# EAGLE design board (EAGLE 6.4)
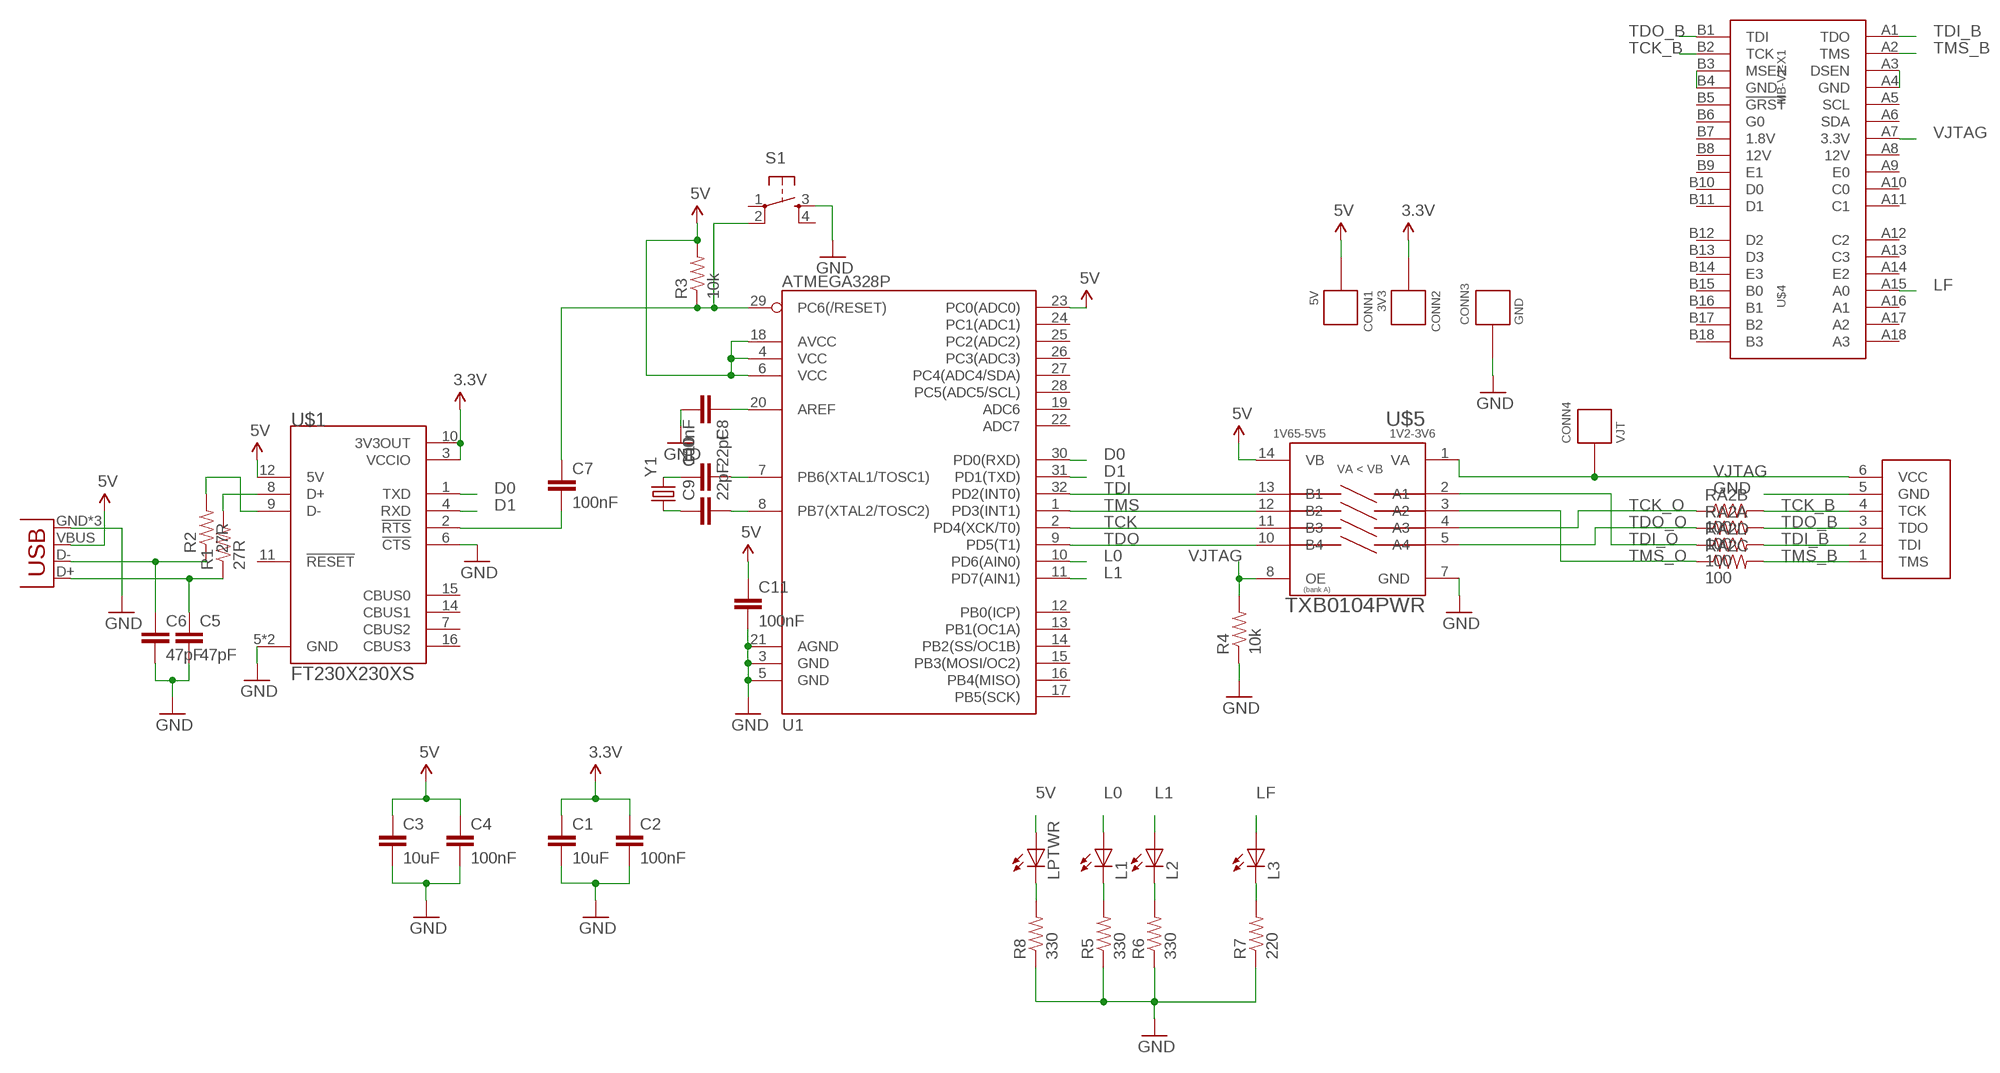
[diagram p0: schematic, sheet 1]

## Parts
C1  10uF  CAP0805  [0805]
C2  100nF  CAP0402-CAP  [0402-CAP]
C3  10uF  CAP0805  [0805]
C4  100nF  CAP0402-CAP  [0402-CAP]
C5  47pF  CAP0402-CAP  [0402-CAP]
C6  47pF  CAP0402-CAP  [0402-CAP]
C7  100nF  CAP0402-CAP  [0402-CAP]
C8  100nF  CAP0402-CAP  [0402-CAP]
C9  22pF  CAP0402-CAP  [0402-CAP]
C10  22pF  CAP0402-CAP  [0402-CAP]
C11  100nF  CAP0402-CAP  [0402-CAP]
CONN1  5V  CONNECTOR22AWG  [HOLE_22AWG]
CONN2  3V3  CONNECTOR22AWG  [HOLE_22AWG]
CONN3  GND  CONNECTOR22AWG  [HOLE_22AWG]
CONN4  VJT  CONNECTOR22AWG  [HOLE_22AWG]
JP1  USB-MICROB  [USB-MICROB]
L1  LED0603  [0603_LED]
L2  LED0603  [0603_LED]
L3  LED0603  [0603_LED]
LPTWR  LED0603  [0603_LED]
R1  27R  RESISTOR0603  [0603-RES]
R2  27R  RESISTOR0603  [0603-RES]
R3  10k  RESISTOR0603  [0603-RES]
R4  10k  RESISTOR0603  [0603-RES]
R5  330  RESISTOR0603  [0603-RES]
R6  330  RESISTOR0603  [0603-RES]
R7  220  RESISTOR0603  [0603-RES]
R8  330  RESISTOR0603  [0603-RES]
RA2  100  RESISTOR_ARRAY0603_X4  [0603-ARV]
S1  TAC_SWITCHPTH  [TACTILE-PTH]
U1  ATMEGA328P  ATMEGA328_SMT  [TQFP32-08]
U$1  FT230X230XS  [SO16]
U$2  JTAGDIGILENT  [1X06]
U$4  MB-V1-X1  [PCIE-X1-EDGE]
U$5  TXB0104PWR  [TSSOP14]
Y1  CRYSTALHC49US  [HC49US]

## Nets
3.3V: C1.1 C2.1 CONN2.P U$1.3(VCCIO) U$1.10(3V3OUT)
5V: C3.1 C4.1 C11.1 CONN1.P JP1.VBUS LPTWR.A R3.2 U1.4(VCC) U1.6(VCC) U1.18(AVCC) U1.23(PC0(ADC0)) U$1.12(5V) U$5.14(VB)
D0: U1.30(PD0(RXD)) U$1.1(TXD)
D1: U1.31(PD1(TXD)) U$1.4(RXD)
GND: C1.2 C2.2 C3.2 C4.2 C5.2 C6.2 C8.2 C11.2 CONN3.P JP1.GND JP1.MT1(GND) JP1.MT2(GND) R4.1 R5.1 R6.1 R7.1 R8.1 S1.3 U1.3(GND) U1.5(GND) U1.21(AGND) U$1.5(GND) U$1.6(!CTS) U$1.13(GND) U$2.5(GND) U$4.A3(DSEN) U$4.A4(GND) U$4.B3(MSEN) U$4.B4(GND)
L0: L1.A U1.10(PD6(AIN0))
L1: L2.A U1.11(PD7(AIN1))
LF: L3.A U$4.A15(A0)
LPWR: LPTWR.C R8.2
N$1: R1.2 U$1.8(D+)
N$2: R2.2 U$1.9(D-)
N$3: C6.1 JP1.D- R2.1
N$4: C5.1 JP1.D+ R1.1
N$5: C7.2 U$1.2(!RTS)
N$6: C7.1 R3.1 S1.2 U1.29(PC6(/RESET))
N$7: C10.2 U1.7(PB6(XTAL1/TOSC1))
N$8: C8.1 U1.20(AREF)
N$9: C10.1 Y1.2
N$10: C9.2 U1.8(PB7(XTAL2/TOSC2))
N$11: C9.1 Y1.1
N$12: L1.C R5.2
N$13: L2.C R6.2
N$14: L3.C R7.2
TCK: U1.2(PD4(XCK/T0)) U$5.11(B3)
TCK_B: RA2.7 U$2.4(TCK) U$4.B2(TCK)
TCK_O: RA2.2 U$5.4(A3)
TDI: U1.32(PD2(INT0)) U$5.13(B1)
TDI_B: RA2.5 U$2.2(TDI) U$4.A1(TDO)
TDI_O: RA2.4 U$5.2(A1)
TDO: U1.9(PD5(T1)) U$5.10(B4)
TDO_B: RA2.8 U$2.3(TDO) U$4.B1(TDI)
TDO_O: RA2.1 U$5.5(A4)
TMS: U1.1(PD3(INT1)) U$5.12(B2)
TMS_B: RA2.6 U$2.1(TMS) U$4.A2(TMS)
TMS_O: RA2.3 U$5.3(A2)
VJTAG: CONN4.P R4.2 U$2.6(VCC) U$4.A7(3.3V) U$5.1(VA)
Unconnected: S1.1 S1.4 U1.12(PB0(ICP)) U1.13(PB1(OC1A)) U1.14(PB2(SS/OC1B)) U1.15(PB3(MOSI/OC2)) U1.16(PB4(MISO)) U1.17(PB5(SCK)) U1.19(ADC6) U1.22(ADC7) U1.24(PC1(ADC1)) U1.25(PC2(ADC2)) U1.26(PC3(ADC3)) U1.27(PC4(ADC4/SDA)) U1.28(PC5(ADC5/SCL)) U$1.7(CBUS2) U$1.11(!RESET) U$1.14(CBUS1) U$1.15(CBUS0) U$1.16(CBUS3) U$4.A5(SCL) U$4.A6(SDA) U$4.A8(12V) U$4.A9(E0) U$4.A10(C0) U$4.A11(C1) U$4.A12(C2) U$4.A13(C3) U$4.A14(E2) U$4.A16(A1) U$4.A17(A2) U$4.A18(A3) U$4.B5(!GRST) U$4.B6(G0) U$4.B7(1.8V) U$4.B8(12V) U$4.B9(E1) U$4.B10(D0) U$4.B11(D1) U$4.B12(D2) U$4.B13(D3) U$4.B14(E3) U$4.B15(B0) U$4.B16(B1) U$4.B17(B2) U$4.B18(B3) U$5.7(GND) U$5.8(OE)

## Library data of the parts
C1-C11 = kmod-passives:CAP: Capacitor Standard 0603 ceramic capacitor, and 0.1" leaded capacitor.
CONN1-CONN4 = kmod-nonparts:CONNECTOR: Collection of holes/pads for testing/connecting
JP1 = SparkFun-Connectors:USB: USB Connectors USB-B-PTH is fully proven SKU : PRT-00139/CONN-08278 USB-miniB is fully proven SKU : PRT-00587 USB-A-PCB is untested. USB-A-H is throughly reviewed, but untested. Spark Fun Electronics SKU : PRT-00437 USB-B-SMT is throughly reviewed, but untested. Needs silkscreen touching up. USB-A-S has not been used/tested USB-MB-H has not been used/tested USB-MICROB has been used. CONN-09505; PROD_ID: CONN-09505
L1-L3 LPTWR = kmod-passives:LED
R1-R8 = kmod-passives:RESISTOR: Resistor Basic schematic elements and footprints for 0603, 1206, and PTH resistors.
RA2 = kmod-passives:RESISTOR_ARRAY
S1 = kmod-mechanical:TAC_SWITCH: Momentary Switch Button commonly used for reset or general input. Spark Fun Electronics SKU : COM-00097 SMT- SWCH-08247
U1 = SparkFun-DigitalIC:ATMEGA328_SMT: 32-Pin Atmega328 part Commonly used on Arduino compatible boards Available in QFP and QFN packages TQFP is IC-09069 QFN is non-stock; PROD_ID: IC-09069
U$1 = kmod-testing:FT230X
U$2 = kmod-connectors:JTAG: JTAG connector, as on the Digilent Nexys3
U$4 = kmod-connectors:MB-V1-X1
U$5 = kmod-testing:TXB0104: TI 4-bit bidirectional voltage translator
Y1 = SparkFun-FreqCtrl:CRYSTAL: Various standard crystals. Proven footprints. Spark Fun Electronics SKU : COM-00534

## Board
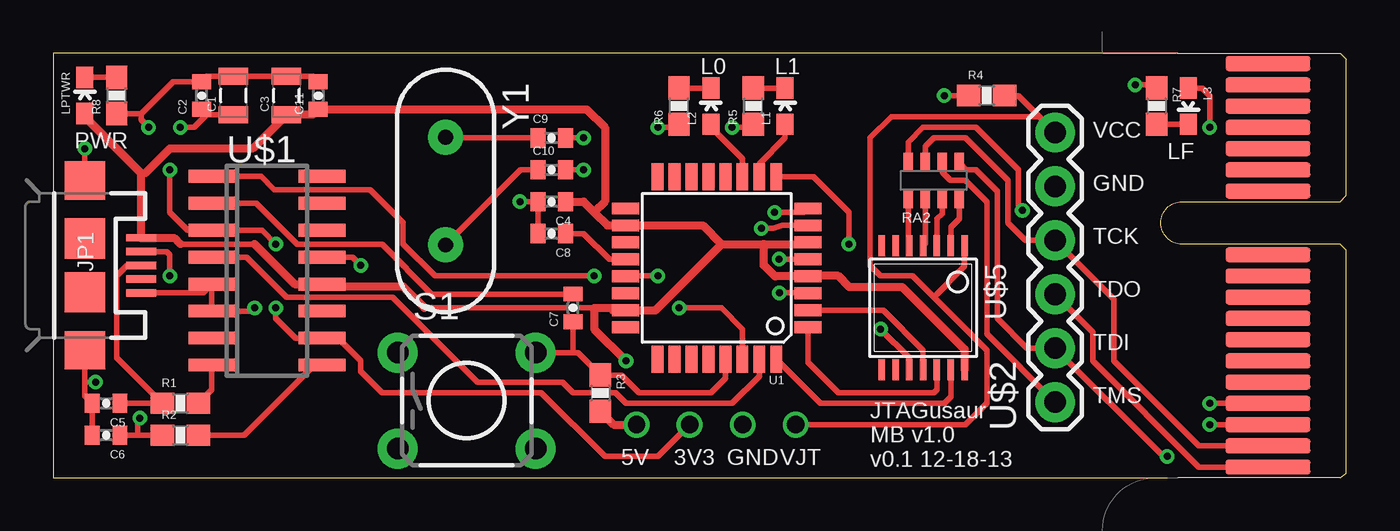
[diagram p1: board, top side]
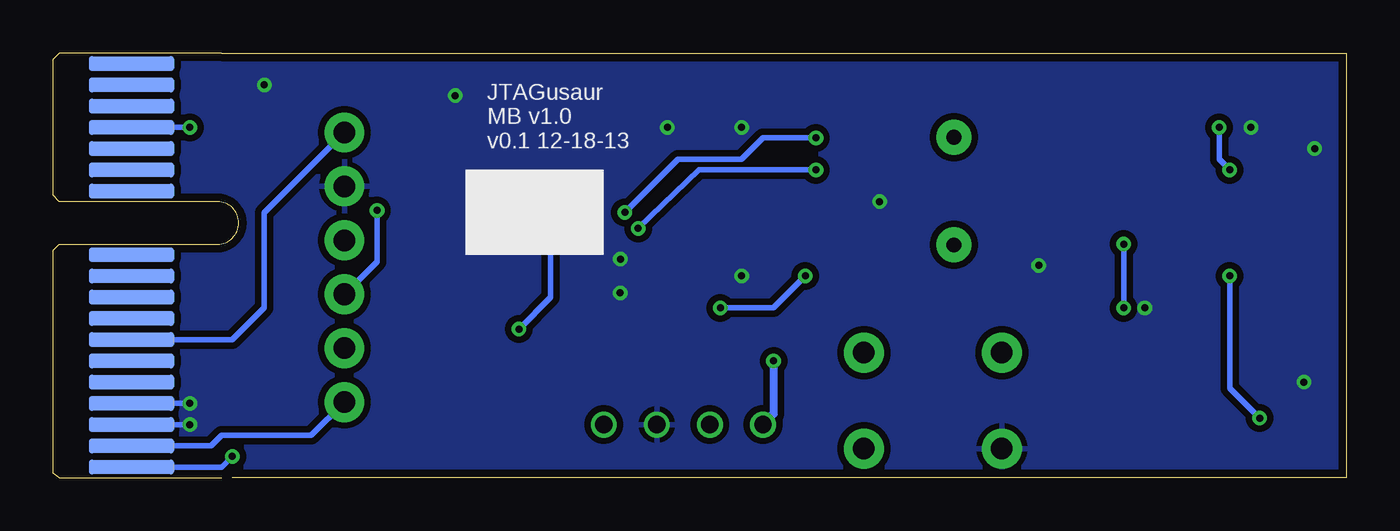
[diagram p2: board, bottom side, seen from below]

Size 60.95 x 20 mm. Coordinates in mm from the lower left corner, seen from the top.
Outline: 52.5,0 0,0 0,20 53,20
Copper layers (1*16): Top 0.0356mm / dielectric 1.5011mm / Bottom 0.0356mm
Design rules "OSHPark_mine": minimum track width 6mil, minimum drill 13mil, track to track 6mil, track to pad 6mil, pad to pad 6mil, via to via 6mil, smd to smd 6mil, copper to edge 15mil, drill to drill 6mil, minimum pad ring 7mil, minimum via ring 7mil, stop-mask expansion 2mil, vias tented up to drill 13mil, thermal gap 10mil

### Footprints (pad centres in the part's own frame; a part is rotated, then mirrored left to right if it is on the bottom)
0805 = smd 0.8 x 1.4: 1 -0.9,0; 2 0.9,0
0402-CAP = smd 0.7 x 0.9: 1 -0.65,0; 2 0.65,0
HOLE_22AWG = drill 0.813: P 0,0
USB-MICROB = smd 0.35 x 1.4: D+ 0,2.65; D- -0.65,2.65; GND 1.3,2.65; ID 0.65,2.65; VBUS -1.3,2.65 | smd 1.8 x 1.9: MT1 -4,0; MT2 4,0 | smd 1.9 x 1.9: P$1 -1.27,0; P$2 1.27,0
0603_LED = smd 0.8 x 1.003: A 0,-0.852; C 0,0.852
0603-RES = smd 1.1 x 1: 1 -0.85,0; 2 0.85,0
0603-ARV = smd 0.45 x 0.9: 1 -1.2,-0.85; 2 -0.4,-0.85; 3 0.4,-0.85; 4 1.2,-0.85; 5 1.2,0.85; 6 0.4,0.85; 7 -0.4,0.85; 8 -1.2,0.85
TACTILE-PTH = drill 1.016 pad 1.88: 1 -3.251,2.261; 2 3.251,2.261; 3 -3.251,-2.261; 4 3.251,-2.261
TQFP32-08 = smd 1.27 x 0.559: 1 -4.293,2.8; 2 -4.293,2; 3 -4.293,1.2; 4 -4.293,0.4; 5 -4.293,-0.4; 6 -4.293,-1.2; 7 -4.293,-2; 8 -4.293,-2.8; 17 4.293,-2.8; 18 4.293,-2; 19 4.293,-1.2; 20 4.293,-0.4; 21 4.293,0.4; 22 4.293,1.2; 23 4.293,2; 24 4.293,2.8 | smd 0.559 x 1.27: 9 -2.8,-4.293; 10 -2,-4.293; 11 -1.2,-4.293; 12 -0.4,-4.293; 13 0.4,-4.293; 14 1.2,-4.293; 15 2,-4.293; 16 2.8,-4.293; 25 2.8,4.293; 26 2,4.293; 27 1.2,4.293; 28 0.4,4.293; 29 -0.4,4.293; 30 -1.2,4.293; 31 -2,4.293; 32 -2.8,4.293
SO16 = smd 0.6 x 2.2: 1 -4.445,-2.6; 2 -3.175,-2.6; 3 -1.905,-2.6; 4 -0.635,-2.6; 5 0.635,-2.6; 6 1.905,-2.6; 7 3.175,-2.6; 8 4.445,-2.6; 9 4.445,2.6; 10 3.175,2.6; 11 1.905,2.6; 12 0.635,2.6; 13 -0.635,2.6; 14 -1.905,2.6; 15 -3.175,2.6; 16 -4.445,2.6
1X06 = drill 1.016 pad 1.88: 1 0,0; 2 2.54,0; 3 5.08,0; 4 7.62,0; 5 10.16,0; 6 12.7,0
PCIE-X1-EDGE = smd 0.7 x 4 bottom: A1 -11.5,-0.75; A2 -10.5,-0.75; A3 -9.5,-0.75; A4 -8.5,-0.75; A5 -7.5,-0.75; A6 -6.5,-0.75; A7 -5.5,-0.75; A8 -4.5,-0.75; A9 -3.5,-0.75; A10 -2.5,-0.75; A11 -1.5,-0.75; A12 1.5,-0.75; A13 2.5,-0.75; A14 3.5,-0.75; A15 4.5,-0.75; A16 5.5,-0.75; A17 6.5,-0.75; A18 7.5,-0.75 | smd 0.7 x 4: B1 -11.5,-0.75; B2 -10.5,-0.75; B3 -9.5,-0.75; B4 -8.5,-0.75; B5 -7.5,-0.75; B6 -6.5,-0.75; B7 -5.5,-0.75; B8 -4.5,-0.75; B9 -3.5,-0.75; B10 -2.5,-0.75; B11 -1.5,-0.75; B12 1.5,-0.75; B13 2.5,-0.75; B14 3.5,-0.75; B15 4.5,-0.75; B16 5.5,-0.75; B17 6.5,-0.75; B18 7.5,-0.75
TSSOP14 = smd 0.305 x 0.991: 1 -1.95,-2.918; 2 -1.3,-2.918; 3 -0.65,-2.918; 4 0,-2.918; 5 0.65,-2.918; 6 1.3,-2.918; 7 1.95,-2.918; 8 1.95,2.918; 9 1.3,2.918; 10 0.65,2.918; 11 0,2.918; 12 -0.65,2.918; 13 -1.3,2.918; 14 -1.95,2.918
HC49US = drill 0.7 pad 1.651: 1 -2.54,0; 2 2.54,0

### Placement (x,y rotation side)
C1  8.5,18 90 top
C2  7,18 90 top
C3  11,18 90 top
C4  23.5,13 180 top
C5  2.5,3.5 180 top
C6  2.5,2 180 top
C7  24.5,8 90 top
C8  23.5,11.5 180 top
C9  23.5,16 0 top
C10  23.5,14.5 0 top
C11  12.5,18 90 top
CONN1  27.5,2.5 0 top
CONN2  30,2.5 0 top
CONN3  32.5,2.5 0 top
CONN4  35,2.5 0 top
JP1  1.5,10 270 top
L1  34.5,17.5 0 top
L2  31,17.5 0 top
L3  53.5,17.5 180 top
LPTWR  1.5,18 0 top
R1  6,3.5 0 top
R2  6,2 0 top
R3  25.79,3.98 270 top
R4  44,18 0 top
R5  33,17.5 90 top
R6  29.5,17.5 90 top
R7  52,17.5 270 top
R8  3,18 90 top
RA2  41.5,14 0 top
S1  19.49,3.63 0 top
U1  31.28,9.88 180 top
U$1  10.08,9.75 270 top
U$2  47.22,3.56 90 top
U$4  56.5,12 90 top
U$5  41,8 180 top
Y1  18.5,13.5 270 top

### Tracks (layer width: path | path; a pad name or v marks a point on that pad's centre or on a via)
3.3V  (via drill 0.33)
  Top 0.254: C2.1 7.25,17.1 | 7.25,17.1 C1.1 | 7.25,17.1 6.65,16.5 v6,16.5 | CONN2.P 28.5,1 26,1 23,4 15.5,4 14.5,5 14.5,5.5 13.43,6.58 U$1.10 11.43,6.58 10.5,7.5 v10.5,8 | v5.5,14.5 5.5,12.5 6.34,11.65 U$1.3 9.85,11.65 v10.5,11
  Bottom 0.254: v6,16.5 6,15 v5.5,14.5 | v10.5,8 v10.5,11
5V  (via drill 0.33)
  Top 0.254: 6,11 9.5,11 | 1.5,17 LPTWR.A | 4.35,14.35 4.15,14.35 | 35.49,11 U1.6 | 35.59,9.5 U1.4 | U1.23 26.38,7.88 | 17.5,8 25.5,8 | 12.79,9 U$1.12
  Top 0.381: 6,11 5.7,11.3 JP1.VBUS 4.15,14.35 1.5,17 | 9.5,11 11.38,9.12 U$1.12 | 4.35,14.35 5.5,15.5 9.4,15.5 C3.1 12.25,17.1 C11.1 25.15,17.35 26,16.5 26,13 25.5,12.5 | C4.1 25,13 25.5,12.5 | 25.5,12.5 26.12,11.88 U1.18 30.62,11.88 31.5,11 | 31.5,11 33.5,11 | 33.5,11 35.49,11 | R3.2 26.42,2.5 CONN1.P | U$5.14 42.95,6.05 40.02,8.98 37.52,8.98 37,9.5 35.59,9.5 | U1.23 28.38,7.88 31.5,11 | 26.38,7.88 26.26,8 25.5,8 25.5,7 v27,5.5 | 17.5,8 16.5,9 12.79,9 | U1.4 34.02,9.48 33.5,10 33.5,11
  Bottom 0.381: v27,5.5 27,3 CONN1.P
D0  (via drill 0.33)
  Top 0.254: U$1.1 9.8,14.2 10.43,13.57 14.93,13.57 16.5,12 16.5,11 18,9.5 v25.5,9.5 | v29.5,8 31.5,8 32.5,7 32.5,5.61 U1.30
  Bottom 0.254: v25.5,9.5 27,8 v29.5,8
D1
  Top 0.254: U$1.4 9.12,10.38 11,8.5 16,8.5 20,4.5 24,4.5 24.5,4 26.5,4 27,3.5 32,3.5 33.28,4.78 U1.31
GND  (via drill 0.33)
  Top 0.254: C11.2 12.25,18.9 C3.2 C1.2 7.25,18.9 C2.2 5.65,18.65 4.15,17.15 | 4.15,17.15 R8.1 | 4.15,17.15 4.15,16.85 v4.5,16.5 | JP1.MT1 v1.5,15.5 | JP1.MT2 1.5,4.5 | 1.5,4.5 1.5,3.85 C5.2 C6.2 | 1.5,4.5 v2,4.5 | JP1.GND 7.07,8.7 U$1.5 U$1.6 9.35,7.84 v9.5,8 | U$1.13 14.12,10.38 v14.5,10 | U1.3 35.55,8.7 v34.23,8.7 | U1.5 v34.21,10.29 | R6.1 29.35,16.5 v28.5,16.5 | R5.1 32.85,16.5 v32,16.5 | v22,13 C4.2 C8.2 | U1.21 27.01,9.5 v28.5,9.5 | R7.1 51.85,18.5 v51,18.5 | v54.5,3.5 U$4.A4 | U$4.A3 v54.5,2.5 | R4.1 v42,18
  Bottom 0.254: U$4.A4 v54.5,3.5 | v54.5,2.5 U$4.A3
  pour Bottom (isolate 0.305): 0,20 56.5,20 56.5,0 0,0
L0
  Top 0.254: U1.10 33.28,14.78 34.5,16 L1.A
L1
  Top 0.254: U1.11 32.48,15.02 31,16.5 L2.A
LF  (via drill 0.33)
  Top 0.254: v54.5,16.5 54.5,18 54.15,18.35 L3.A
  Bottom 0.254: U$4.A15 v54.5,16.5
LPWR
  Top 0.254: LPTWR.C R8.2
N$1
  Top 0.254: R1.2 7.48,4.13 U$1.8
N$2
  Top 0.254: R2.2 9,2 12.3,5.3 U$1.9
N$3  (via drill 0.33)
  Top 0.254: C6.1 4,2 | 4,2 R2.1 | JP1.D- 5.35,10.65 5.5,10.5 v5.5,9.5 | v4.09,2.8 4,2.71 4,2
  Bottom 0.254: v5.5,9.5 5.5,4.21 v4.09,2.8
N$4
  Top 0.254: C5.1 R1.1 3,5.65 3,9.5 3.5,10 JP1.D+
N$5
  Top 0.254: C7.2 17.85,8.65 15.5,11 11.5,11 9.57,12.93 U$1.2
N$6
  Top 0.254: U1.29 31.68,4.68 31,4 27.62,4 26.79,4.83 R3.1 24.73,5.89 24.5,5.89 | S1.2 24.5,5.89 | C7.1 24.5,5.89
N$7  (via drill 0.33)
  Top 0.254: U1.7 34.38,11.88 33.95,11.74 v33.38,11.74 | v25,14.5 C10.2
  Bottom 0.254: v33.38,11.74 30.5,14.5 v25,14.5
N$8
  Top 0.254: C8.1 25,11.5 26.22,10.28 U1.20
N$9
  Top 0.254: Y1.2 22.04,14.5 C10.1
N$10  (via drill 0.33)
  Top 0.254: U1.8 35.39,12.5 v34,12.5 | v25,16 C9.2
  Bottom 0.254: v34,12.5 31.5,15 28.5,15 27.5,16 v25,16
N$11
  Top 0.254: Y1.1 18.54,16 C9.1
N$12
  Top 0.254: R5.2 L1.C
N$13
  Top 0.254: R6.2 L2.C
N$14
  Top 0.254: L3.C 53,16.65 R7.2
TCK
  Top 0.254: U$5.11 41,6 39.12,7.88 U1.2
TCK_B
  Top 0.254: U$4.B2 54,1.5 50,5.5 50,8.4 U$2.4 45.82,11.18 45,12 45,14 43,16 41.5,16 41.1,15.6 RA2.7
TCK_O
  Top 0.254: U$5.4 41.1,11.02 RA2.2
TDI
  Top 0.254: U$5.13 42.3,3.8 42,3.5 36.17,3.5 U1.32
TDI_B  (via drill 0.33)
  Top 0.254: v52.5,1 52.32,1 U$2.2 45.9,6.1 44.5,7.5 44.5,13.5 43.5,14.5 43.05,14.5 RA2.5
  Bottom 0.254: v52.5,1 53,0.5 U$4.A1
TDI_O
  Top 0.254: U$5.2 42.3,11.8 42.7,12.2 RA2.4
TDO  (via drill 0.33)
  Top 0.254: U$5.10 40.35,5.65 v39,7 | v37.5,11 37.5,12.5 35.83,14.17 U1.9
  Bottom 0.254: v39,7 37.5,8.5 v37.5,11
TDO_B  (via drill 0.33)
  Top 0.254: U$2.3 49,6.86 49,5.5 54,0.5 U$4.B1 | RA2.8 40.3,15.8 41,16.5 43.5,16.5 45.5,14.5 45.5,12.77 v45.68,12.59
  Bottom 0.254: v45.68,12.59 45.68,10.18 U$2.3
TDO_O
  Top 0.254: U$5.5 40.3,10.97 RA2.1
TMS
  Top 0.254: U$5.12 41.65,4.15 41.5,4 37,4 35.57,5.43 U1.1
TMS_B
  Top 0.254: U$2.1 44,6.78 44,13 43,14 42.29,14 41.9,14.39 RA2.6
  Bottom 0.254: U$2.1 48.78,2 53,2 53.5,1.5 U$4.A2
TMS_O
  Top 0.254: RA2.3 41.9,12.44 41.65,12.19 U$5.3
VJTAG
  Top 0.254: U$2.6 46.49,16.99 46.48,17 | 46.48,17 45.48,18 R4.2 | CONN4.P 43,2.5 44,3.5 44,6 41.5,8.5 | 41.5,8.5 40.5,9.5 39,9.5 38.5,10 38.5,16 39.5,17 46.48,17 | U$5.1 42.95,9.95 41.5,8.5
  Bottom 0.254: U$2.6 51,12.48 51,8 52.5,6.5 U$4.A7

### Text on the board
tPlace: L0 | L1 | PWR | VCC | LF | GND | TCK | TDO | TDI | TMS | JTAGusaur / MB v1.0 / v0.1 12-18-13
bPlace: JTAGusaur / MB v1.0 / v0.1 12-18-13